# Altium schematic sheet Rs232.SchDoc: Oven Driver
size A4; DrawnBy: Łukasz Przeniosło; Organization: Altium Limited; Address1: L3, 12a Rodborough Rd; Address2: Frenchs Forest; Address3: NSW; Address4: Australia 2086; DocumentNumber: 10; SheetNumber: 10; SheetTotal: 13; Number: MS02-50-42-00; Time: Oven Driver
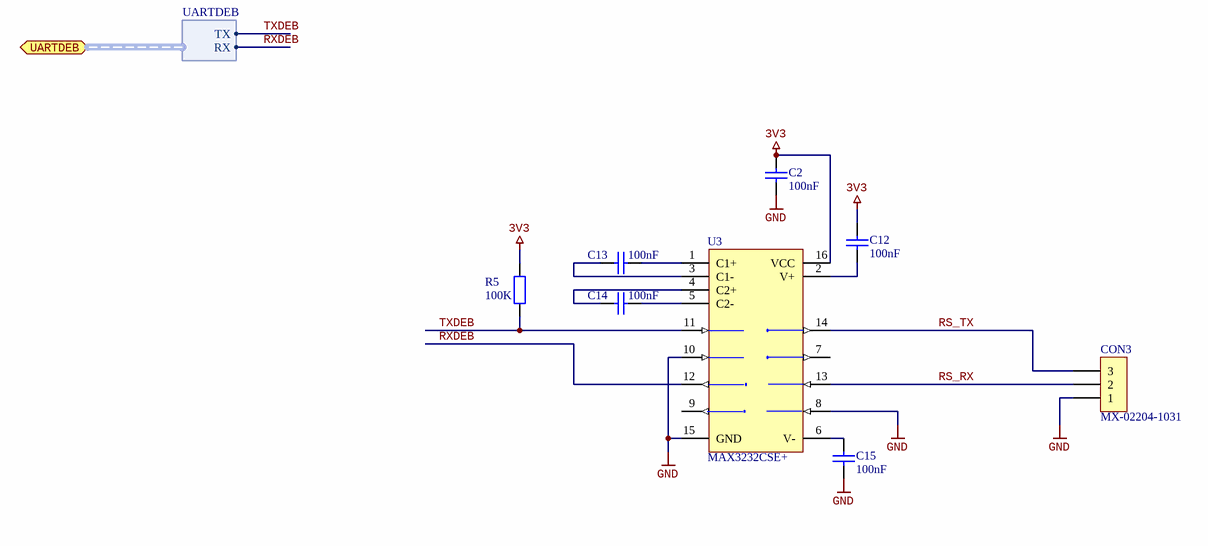
[diagram p0: Rs232.SchDoc]

## Parts
C2  100nF  [CAPC1608N]
C12  100nF  [CAPC1608N]
C13  100nF  [CAPC1608N]
C14  100nF  [CAPC1608N]
C15  100nF  [CAPC1608N]
CON3  MX-02204-1031  [MX-02204-1031]
R5  100K  [RESC1608N]
U3  MAX3232CSE+  [SO16_N]

## Ports
UARTDEB (harness UARTDEB)

## Harnesses
UARTDEB: TX, RX

## Nets
3V3: C2.2 C12.2 R5.2 U3.16(VCC)
GND: C2.1 C15.1 CON3.1 U3.8(R2IN) U3.10(T2IN) U3.15(GND)
RS_RX: CON3.2 U3.13(R1IN)
RS_TX: CON3.3 U3.14(T1OUT)
RXDEB: U3.12(R1OUT) ; port UARTDEB.RX
TXDEB: R5.1 U3.11(T1IN) ; port UARTDEB.TX
NetC12_1: C12.1 U3.2(V+)
NetC13_1: C13.1 U3.3(C1-)
NetC13_2: C13.2 U3.1(C1+)
NetC14_1: C14.1 U3.4(C2+)
NetC14_2: C14.2 U3.5(C2-)
NetC15_2: C15.2 U3.6(V-)

Not connected (* = marked no-connect by the designer): U3 7(T2OUT) 9(R2OUT)

## Notes on the sheet
- Title:
- Date:
- Drawn by:
- Project:
- Time:
- Number:
- Sheet
- of
- File:

## Library data of the parts
C2 C12-C15 = Capacitor: Value: 100nF
CON3 = MX-02204-1031: Pith 2.54mm, 3-pin; ComponentLink1Description: Manufacturer Link; ComponentLink2Description: Datasheet; Distributor: tme.pl; tme.pl: MX-6410-03A
R5 = Resistor: Power: 0W; Tolerance: 5%; Value: 100K
U3 = MAX3232CUE: 3.0V TO 5.5V, Low-Power, up to 1Mbps, True RS-232 Transceiver Using Four 0.1µF External Capacitor; Published: 16-Jan-2001; LatestRevisionDate: 29-May-2009; LatestRevisionNote: IPC-7351 Footprint Added.; DatasheetVersion: Mar-1999; PackageVersion: 21-0066 C; PackageReference: TSSOP16; Publisher: Altium Limited; PackageDescription: 16-Pin Thin Small Outline Package 0.65 mm Pitch; ComponentLink1Description: Manufacturer Link; ComponentLink1URL: http://www.maxim-ic.com/; ComponentLink2Description: Datasheet; ComponentLink2URL: http://pdfserv.maxim-ic.com/en/ds/MAX3222-MAX3241.pdf